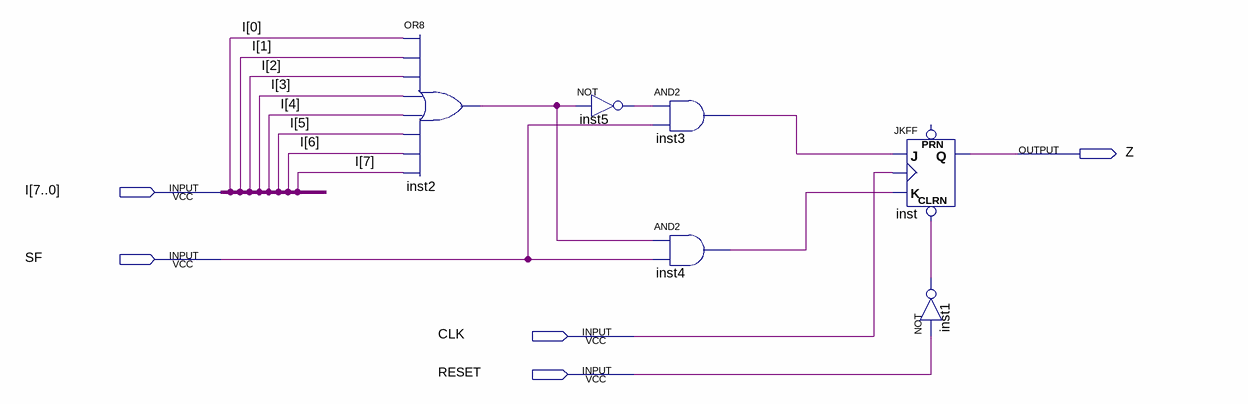
[diagram p0: schematic sheet]
// Quartus schematic JKFLIPFLOP.bdf as structural Verilog: 6 symbols, 5 pins
module JKFLIPFLOP (
  input  [7:0] I,
  input  SF,
  input  CLK,
  input  RESET,
  output Z
);

  wire inst1_out, inst2_out, inst3_out, inst4_out, inst5_out;

  or inst2 (inst2_out, I[0], I[1], I[2], I[3], I[4], I[5], I[6], I[7]);
  not inst5 (inst5_out, inst2_out);
  and inst3 (inst3_out, inst5_out, SF);
  and inst4 (inst4_out, inst2_out, SF);
  JKFF inst (.CLRN(inst1_out), .K(inst4_out), .J(inst3_out), .CLK(CLK), .Q(Z));  // open: PRN
  not inst1 (inst1_out, RESET);
endmodule
